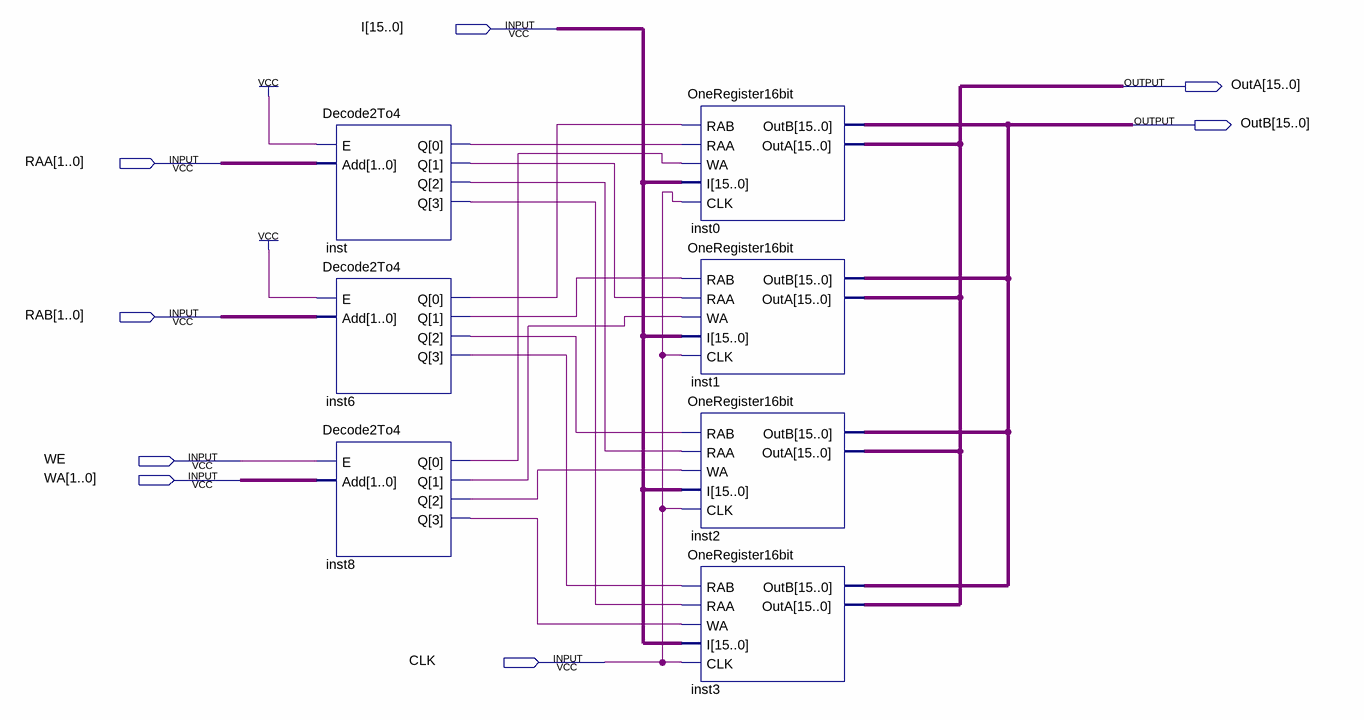
[diagram p0: schematic sheet]
// Quartus schematic FourReg16bit.bdf as structural Verilog: 7 symbols, 8 pins
module FourReg16bit (
  input  [15:0] I,
  input  [1:0] RAA,
  input  [1:0] RAB,
  input  WE,
  input  [1:0] WA,
  input  CLK,
  output [15:0] OutA,
  output [15:0] OutB
);

  wire inst6_q, inst6_q_2, inst6_q_3, inst6_q_4, inst8_q, inst8_q_2, inst8_q_3, inst8_q_4, inst_q, inst_q_2,
       inst_q_3, inst_q_4;

  Decode2To4 inst (.E(1'b1), .Add(RAA), .Q({inst_q_4, inst_q_3, inst_q_2, inst_q}));
  Decode2To4 inst6 (.E(1'b1), .Add(RAB), .Q({inst6_q_4, inst6_q_3, inst6_q_2, inst6_q}));
  Decode2To4 inst8 (.E(WE), .Add(WA), .Q({inst8_q_4, inst8_q_3, inst8_q_2, inst8_q}));
  OneRegister16bit inst0 (.RAB(inst6_q), .RAA(inst_q), .WA(inst8_q), .I(I), .CLK(CLK), .OutB(OutB), .OutA(OutA));
  OneRegister16bit inst1 (.RAB(inst6_q_2), .RAA(inst_q_2), .WA(inst8_q_2), .I(I), .CLK(CLK), .OutB(OutB), .OutA(OutA));
  OneRegister16bit inst2 (.RAB(inst6_q_3), .RAA(inst_q_3), .WA(inst8_q_3), .I(I), .CLK(CLK), .OutB(OutB), .OutA(OutA));
  OneRegister16bit inst3 (.RAB(inst6_q_4), .RAA(inst_q_4), .WA(inst8_q_4), .I(I), .CLK(CLK), .OutB(OutB), .OutA(OutA));
endmodule
